# Altium schematic sheet LVDS.SchDoc: Apalis Evaluation Board 1.1
size A3; Organization: Toradex AG; Address1: Altsagenstrasse 5; Address2: Horw; Address3: 6048; Address4: Switzerland; DocumentNumber: 22; Revision: V1.1; SheetNumber: 22; SheetTotal: 32; PageSetup: Record=PageOptions|CenterHorizontal=True|CenterVertical=True|PrintScale=0.73|XCorrection=1.00|YCorrection=1.00|PrintKind=0|BorderSize=5000000|LeftOffset=0|BottomOffset=0|Orientation=2|PaperLength=1000|PaperWidth=1000|Scale=100|PaperSource=7|PrintQuality=-4|MediaType=1|DitherType=10|PaperKind=A4|PrintScaleMode=1
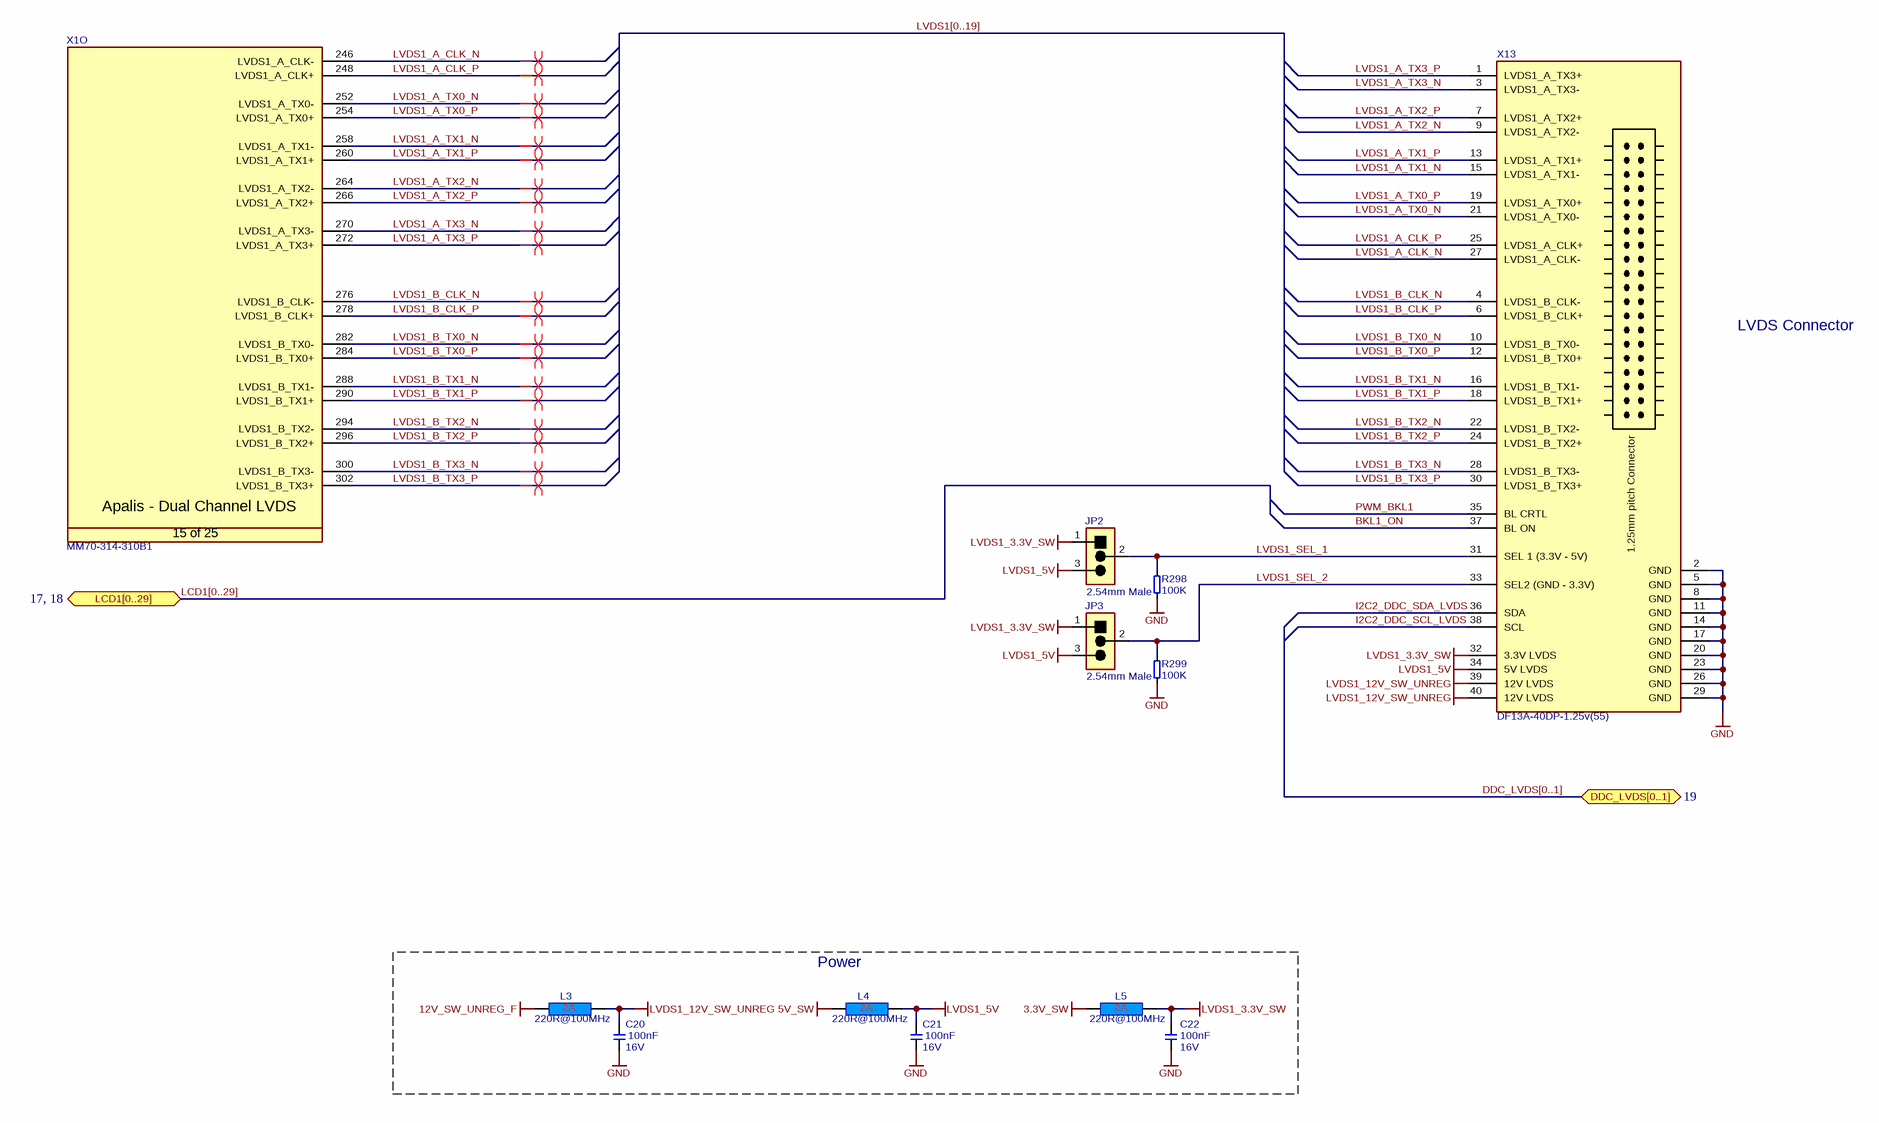
[diagram p0: LVDS.SchDoc]

## Parts
C20  Rating: 16V  [T_CAPC0603X33N]  (hidden comment: 100nF)
C21  Rating: 16V  [T_CAPC0603X33N]  (hidden comment: 100nF)
C22  Rating: 16V  [T_CAPC0603X33N]  (hidden comment: 100nF)
JP2  826936-3  [T_TYCO_826936-3]  (value not drawn)
JP3  826936-3  [T_TYCO_826936-3]  (value not drawn)
L3  220R@100MHz  [INDC1608X95N]
L4  220R@100MHz  [INDC1608X95N]
L5  220R@100MHz  [INDC1608X95N]
R298  100K  [T_RESC0603X30N]
R299  100K  [T_RESC0603X30N]
X1  Manufacturer Part No.: MM70-314-310B1  [T_JAE_MM70-314-310B1]  (hidden comment: CON-JAE-MM70-314-310B1-314-0.5mm)  (part O of 25)
X13  Manufacturer Part No.: DF13A-40DP-1.25v(55)  [T_HIROSE_DF13A-40DP-1.25V(55)]  (hidden comment: CON-Hirose-DF13A-40DP-1.25v(55)-2x10-1mm)

## Blocks framed on the sheet
Power: C20-C22 L3-L5

## Ports
DDC_LVDS[0..1] (bidir, see 19), LCD1[0..29] (bidir, see 17, 18)

## Nets
3.3V_SW: L5.1
5V_SW: L4.1
12V_SW_UNREG_F: L3.1
GND: C20.1 C21.1 C22.1 R298.1 R299.1 X13.2(GND) X13.5(GND) X13.8(GND) X13.11(GND) X13.14(GND) X13.17(GND) X13.20(GND) X13.23(GND) X13.26(GND) X13.29(GND)
LVDS1_3.3V_SW: C22.2 JP2.1 JP3.1 L5.2 X13.32(3.3V_LVDS)
LVDS1_5V: C21.2 JP2.3 JP3.3 L4.2 X13.34(5V_LVDS)
LVDS1_12V_SW_UNREG: C20.2 L3.2 X13.39(12V_LVDS) X13.40(12V_LVDS)
BKL1_ON: X13.37(BL_ON)
I2C2_DDC_SCL_LVDS: X13.38(SCL)
I2C2_DDC_SDA_LVDS: X13.36(SDA)
LVDS1_A_CLK_N: X1.246(LVDS1_A_CLK-) X13.27(LVDS1_A_CLK-)
LVDS1_A_CLK_P: X1.248(LVDS1_A_CLK+) X13.25(LVDS1_A_CLK+)
LVDS1_A_TX0_N: X1.252(LVDS1_A_TX0-) X13.21(LVDS1_A_TX0-)
LVDS1_A_TX0_P: X1.254(LVDS1_A_TX0+) X13.19(LVDS1_A_TX0+)
LVDS1_A_TX1_N: X1.258(LVDS1_A_TX1-) X13.15(LVDS1_A_TX1-)
LVDS1_A_TX1_P: X1.260(LVDS1_A_TX1+) X13.13(LVDS1_A_TX1+)
LVDS1_A_TX2_N: X1.264(LVDS1_A_TX2-) X13.9(LVDS1_A_TX2-)
LVDS1_A_TX2_P: X1.266(LVDS1_A_TX2+) X13.7(LVDS1_A_TX2+)
LVDS1_A_TX3_N: X1.270(LVDS1_A_TX3-) X13.3(LVDS1_A_TX3-)
LVDS1_A_TX3_P: X1.272(LVDS1_A_TX3+) X13.1(LVDS1_A_TX3+)
LVDS1_B_CLK_N: X1.276(LVDS1_B_CLK-) X13.4(LVDS1_B_CLK-)
LVDS1_B_CLK_P: X1.278(LVDS1_B_CLK+) X13.6(LVDS1_B_CLK+)
LVDS1_B_TX0_N: X1.282(LVDS1_B_TX0-) X13.10(LVDS1_B_TX0-)
LVDS1_B_TX0_P: X1.284(LVDS1_B_TX0+) X13.12(LVDS1_B_TX0+)
LVDS1_B_TX1_N: X1.288(LVDS1_B_TX1-) X13.16(LVDS1_B_TX1-)
LVDS1_B_TX1_P: X1.290(LVDS1_B_TX1+) X13.18(LVDS1_B_TX1+)
LVDS1_B_TX2_N: X1.294(LVDS1_B_TX2-) X13.22(LVDS1_B_TX2-)
LVDS1_B_TX2_P: X1.296(LVDS1_B_TX2+) X13.24(LVDS1_B_TX2+)
LVDS1_B_TX3_N: X1.300(LVDS1_B_TX3-) X13.28(LVDS1_B_TX3-)
LVDS1_B_TX3_P: X1.302(LVDS1_B_TX3+) X13.30(LVDS1_B_TX3+)
LVDS1_SEL_1: JP2.2 R298.2 X13.31(SEL_1_(3.3V_-_5V))
LVDS1_SEL_2: JP3.2 R299.2 X13.33(SEL2_(GND_-_3.3V))
PWM_BKL1: X13.35(BL_CRTL)

## Buses and harness runs
bus DDC_LVDS[0..1] = port DDC_LVDS[0..1]
bus LCD1[0..29] = port LCD1[0..29]
bus LVDS1[0..19]

## Layout directives
differential pair: LVDS1_A_CLK_N, LVDS1_A_CLK_P, LVDS1_A_TX0_N, LVDS1_A_TX0_P, LVDS1_A_TX1_N, LVDS1_A_TX1_P, LVDS1_A_TX2_N, LVDS1_A_TX2_P, LVDS1_A_TX3_N, LVDS1_A_TX3_P, LVDS1_B_CLK_N, LVDS1_B_CLK_P, LVDS1_B_TX0_N, LVDS1_B_TX0_P, LVDS1_B_TX1_N, LVDS1_B_TX1_P, LVDS1_B_TX2_N, LVDS1_B_TX2_P, LVDS1_B_TX3_N, LVDS1_B_TX3_P

## Notes on the sheet
- (near X13) LVDS Connector
- 2.54mm Male
- Title
- Size:
- Date:
- A3
- Number:
- Time:
- Revision:
- Sheet
- of
- File:
- (in symbol CON-Hirose-DF13A-40DP-1.25v(55)-2x20-1.25mm) 1.25mm pitch Connector
- (in symbol CON-JAE-MM70-314-310B1-314-0.5mm, part O) Apalis - Dual Channel LVDS; 15 of 25

## Library data of the parts
C20-C22 = C-X7R-100nF-16V-10%-0603: Capacitor Ceramic X7R 100nF 16V 10% 0603; Tolerance: 10%; Type: X7R; Value: 100nF
JP2 JP3 = CON-Tyco-826936-3-1X3-2.54mm-JP: Jumper, 3-Pin; Manufacturer Name: Tyco; No. of ways: 1X3; Pitch: 2.54mm; Manufacturer Part No.: 826936-3
L3-L5 = L-220R@100MHz-2A-25%-0603: 220R@100MHz 2A EMI FILTER; Tolerance: 25%; Rating: 2A; Value: 220R@100MHz
R298 R299 = R-100KR-63mW-5%-0603: Resistor 100 Kohm 63mW 5% 0603; Value: 100KR; Rating: 63mW; Tolerance: 5%
X1 = CON-JAE-MM70-314-310B1-314-0.5mm: MXM3 Connector; Manufacturer Name: JAE; No. of ways: 314
X13 = CON-Hirose-DF13A-40DP-1.25v(55)-2x20-1.25mm: LVDS Connector; Manufacturer Name: Hirose; No. of ways: 2x20; Pitch: 1.25mm